# Altium schematic sheet Zigbit.SchDoc
size A
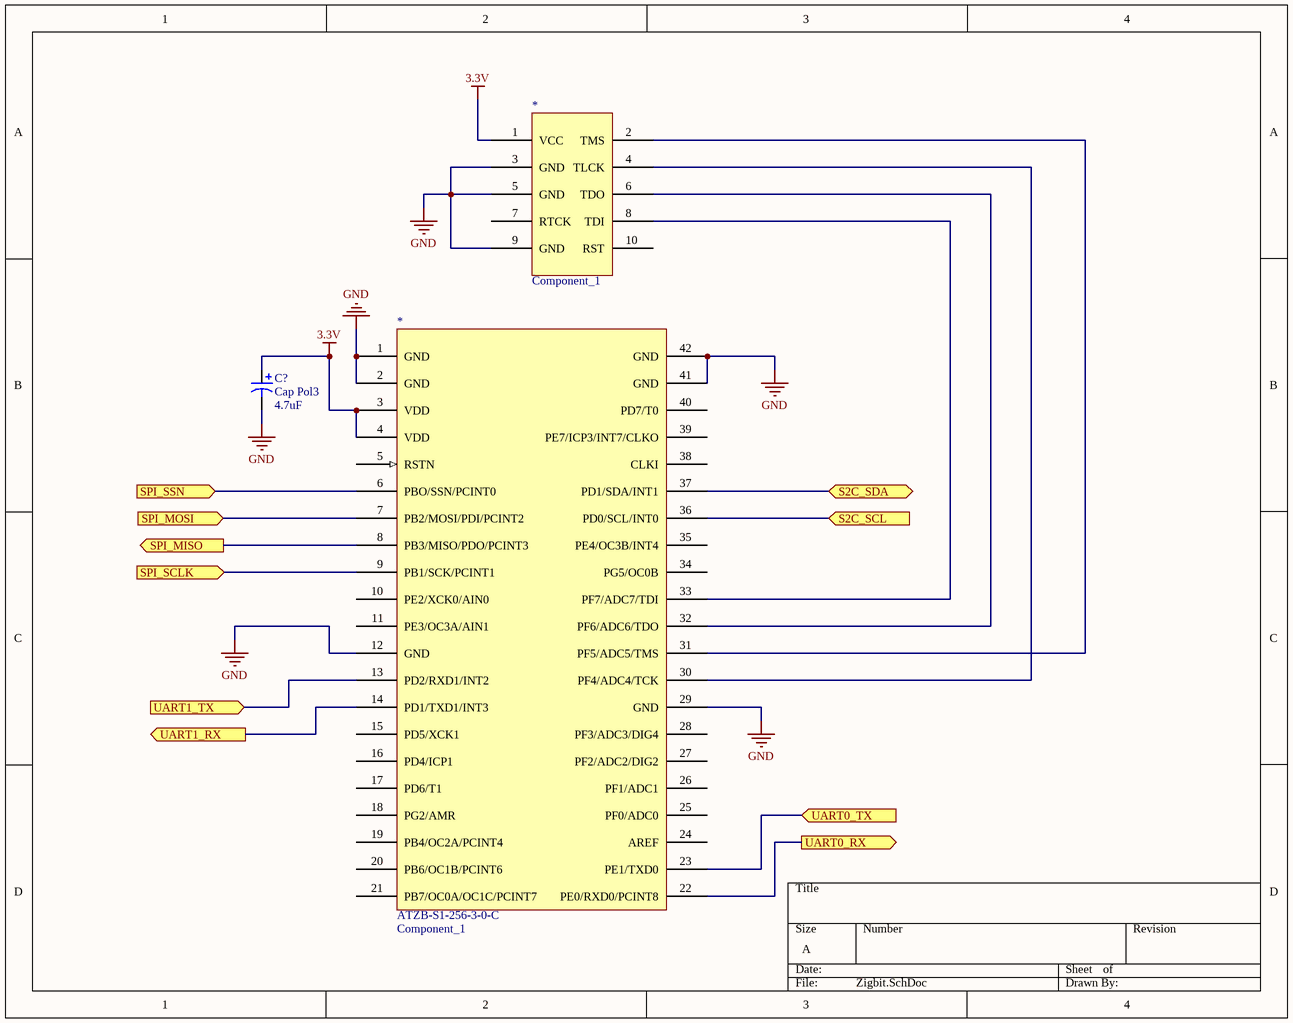
[diagram p0: Zigbit.SchDoc]

## Parts
(Parts that share a designator on the sheet are numbered #1, #2 ... from top to bottom, then left to right.)
*#1  Component_1  [PCBComponent_1]
*#2  Component_1
*#3  Component_1  [PCBComponent_1]
C?  Cap Pol3  value 4.7uF  [C0805]

## Ports
S2C_SCL (in), S2C_SDA (bidir), SPI_MISO (out), SPI_MOSI (in), SPI_SCLK (in), SPI_SSN (in), UART0_RX (out), UART0_TX (in), UART1_RX (out), UART1_TX (in)

## Nets
3.3V: *#1.1(VCC) *#3.3(VDD) *#3.4(VDD) C?.1
GND: *#1.3(GND) *#1.5(GND) *#1.9(GND) *#3.1(GND) *#3.2(GND) *#3.12(GND) *#3.29(GND) *#3.41(GND) *#3.42(GND) C?.2
S2C_SCL: *#3.36(PD0/SCL/INT0) ; port S2C_SCL
S2C_SDA: *#3.37(PD1/SDA/INT1) ; port S2C_SDA
SPI_MISO: *#3.8(PB3/MISO/PDO/PCINT3) ; port SPI_MISO
SPI_MOSI: *#3.7(PB2/MOSI/PDI/PCINT2) ; port SPI_MOSI
SPI_SCLK: *#3.9(PB1/SCK/PCINT1) ; port SPI_SCLK
SPI_SSN: *#3.6(PBO/SSN/PCINT0) ; port SPI_SSN
UART0_RX: *#3.22(PE0/RXD0/PCINT8) ; port UART0_RX
UART0_TX: *#3.23(PE1/TXD0) ; port UART0_TX
UART1_RX: *#3.14(PD1/TXD1/INT3) ; port UART1_RX
UART1_TX: *#3.13(PD2/RXD1/INT2) ; port UART1_TX
Net*#1_2: *#1.2(TMS) *#3.31(PF5/ADC5/TMS)
Net*#1_4: *#1.4(TLCK) *#3.30(PF4/ADC4/TCK)
Net*#1_6: *#1.6(TDO) *#3.32(PF6/ADC6/TDO)
Net*#1_8: *#1.8(TDI) *#3.33(PF7/ADC7/TDI)

Not connected (* = marked no-connect by the designer): *#1 7(RTCK) 10(RST); *#3 5(RSTN) 10(PE2/XCK0/AIN0) 11(PE3/OC3A/AIN1) 15(PD5/XCK1) 16(PD4/ICP1) 17(PD6/T1) 18(PG2/AMR) 19(PB4/OC2A/PCINT4) 20(PB6/OC1B/PCINT6) 21(PB7/OC0A/OC1C/PCINT7) 24(AREF) 25(PF0/ADC0) 26(PF1/ADC1) 27(PF2/ADC2/DIG2) 28(PF3/ADC3/DIG4) 34(PG5/OC0B) 35(PE4/OC3B/INT4) 38(CLKI) 39(PE7/ICP3/INT7/CLKO) 40(PD7/T0)

## Notes on the sheet
- (in symbol Component_1) ATZB-S1-256-3-0-C

## Library data of the parts
C? = Cap Pol3: Polarized Capacitor (Surface Mount); Published: 8-Jun-2000; LatestRevisionDate: 29-May-2009; LatestRevisionNote: IPC-7351 Footprint Added.; PackageReference: C0805; Publisher: Altium Limited; PackageDescription: Chip Capacitor